# Altium schematic sheet TPS54292.SchDoc: 3.3V+1.2V
size A4; Date: 08.04.2017; Author: Jan Petrik; CompanyName: FreeDSP; DrawnBy: Jan Petrik; Organization: FreeDSP; DocumentNumber: 5; Revision: B2; SheetNumber: 5; SheetTotal: 16; email: jan_petrik@centrum.cz; license: CC BY-NC 4.0
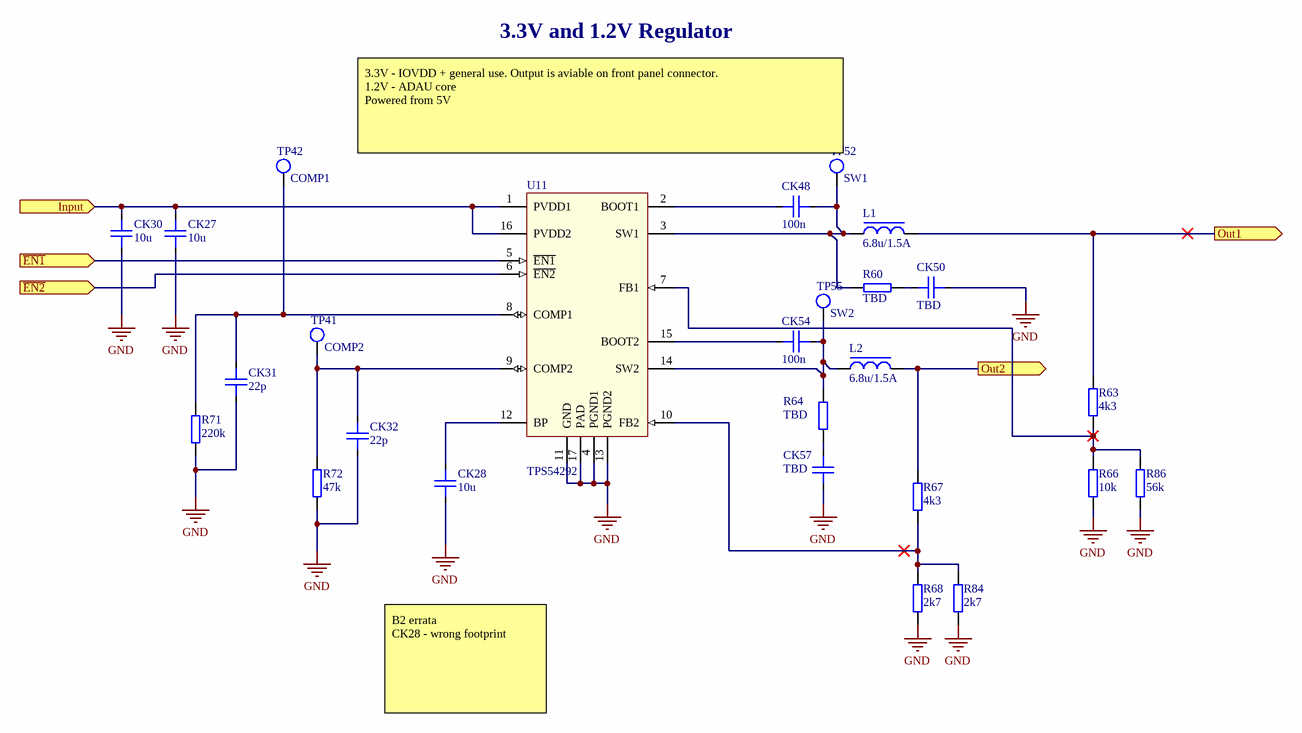
[diagram p0: TPS54292.SchDoc]

## Parts
CK27  10u  [CAPC3216X12N(SMC1206)]
CK28  10u  [CAPC3216X12N(SMC1206)]
CK30  10u  [CAPC3216X12N(SMC1206)]
CK31  22p  [CAPC1608X09N(SMC0603)]
CK32  22p  [CAPC1608X09N(SMC0603)]
CK48  100n  [CAPC1608X09N(SMC0603)]
CK50  TBD  [CAPC1608X09N(SMC0603)]
CK54  100n  [CAPC1608X09N(SMC0603)]
CK57  TBD  [CAPC1608X09N(SMC0603)]
L1  6.8u/1.5A  [INDM_3.8x3.8x1.8]
L2  6.8u/1.5A  [INDM_3.8x3.8x1.8]
R60  TBD  [RESC1608X06N(SMR0603)]
R63  4k3  [RESC1608X06N(SMR0603)]
R64  TBD  [RESC1608X06N(SMR0603)]
R66  10k  [RESC1608X06N(SMR0603)]
R67  4k3  [RESC1608X06N(SMR0603)]
R68  2k7  [RESC1608X06N(SMR0603)]
R71  220k  [RESC1608X06N(SMR0603)]
R72  47k  [RESC1608X06N(SMR0603)]
R84  2k7  [RESC1608X06N(SMR0603)]
R86  56k  [RESC1608X06N(SMR0603)]
TP41  COMP2  [TP_0.8/0.4_ROUND]  (no BOM)
TP42  COMP1  [TP_0.8/0.4_ROUND]  (no BOM)
TP52  SW1  [TP_0.8/0.4_ROUND]  (no BOM)
TP55  SW2  [TP_0.8/0.4_ROUND]  (no BOM)
U11  TPS54292  [TSOP65P640X120_HS-17M(TSSOP16-TP)]

## Ports
Input (in), Out1 (out), Out2 (out), ~{EN1} (in), ~{EN2} (in)

## Nets
GND: CK27.2 CK28.2 CK30.2 CK31.1 CK32.1 CK50.2 CK57.2 R66.1 R68.1 R71.1 R72.1 R84.1 R86.1 U11.4(PGND1) U11.11(GND) U11.13(PGND2) U11.17(PAD)
~{EN1}: U11.5(~{EN1}) ; port ~{EN1}
~{EN2}: U11.6(~{EN2}) ; port ~{EN2}
Input: CK27.1 CK30.1 U11.1(PVDD1) U11.16(PVDD2) ; port Input
Out1: L1.2 R63.2 ; port Out1
Out2: L2.2 R67.2 ; port Out2
NetCK28_1: CK28.1 U11.12(BP)
NetCK31_2: CK31.2 R71.2 TP42.1 U11.8(COMP1)
NetCK32_2: CK32.2 R72.2 TP41.1 U11.9(COMP2)
NetCK48_1: CK48.1 U11.2(BOOT1)
NetCK48_2: CK48.2 L1.1 R60.2 TP52.1 U11.3(SW1)
NetCK50_1: CK50.1 R60.1
NetCK54_1: CK54.1 U11.15(BOOT2)
NetCK54_2: CK54.2 L2.1 R64.2 TP55.1 U11.14(SW2)
NetCK57_1: CK57.1 R64.1
NetR63_1: R63.1 R66.2 R86.2 U11.7(FB1)
NetR67_1: R67.1 R68.2 R84.2 U11.10(FB2)

## Notes on the sheet
- 3.3V and 1.2V Regulator
- (near TP52) 3.3V - IOVDD + general use. Output is aviable on front panel connector.
  1.2V - ADAU core
  Powered from 5V
- B2 errata
  CK28 - wrong footprint
- Designed by:
- Sheet Title:
- Board Revision:
- License:
- Email:
- www.freedsp.cc
- www.pidsp.com
- Date:
- Sheet:
- /

## Library data of the parts
CK27 CK28 CK30 = 10u-50V-1206-X5R: MLCC; Signal Integrity: Cap; Voltage: 50; Tolerance: 10%; Mfgr. PN: GRM31CR61H106MA2L; Mfgr.: Murata; Value: 10u; Package: SMC1206; Simulation: Cap; Author: JP/10.06.2014; Supplier 1: Mouser; Supplier Part Number 1: 81-GRM31CR61H106MA2L
  CK27 CK30: ClassName: DirectConnect
CK31 CK32 = 22p-50V-0603-NP0: MLCC; Signal Integrity: Cap; Tolerance: 10%; Voltage: 50V; Value: 22p; Package: SMC0603; Simulation: Cap; Author: JP/27.03.2014; Supplier 1: Mouser; Supplier Part Number 1: 81-GCM1885C1H220J16D
CK48 CK54 = 100n-50V-0603-X7R: MLCC; Signal Integrity: Cap; Voltage: 50V; Tolerance: 10%; Value: 100n; Package: SMC2523; Simulation: Cap; Author: JP/27.03.2014; Supplier 1: Mouser; Supplier Part Number 1: 81-GRM39X104K50D
CK50 CK57 = ECK+100N50V0603XXK: MLCC, Size 0603, 100nF/50V, X7R; Value: 1n; Signal Integrity: Cap; Tolerance & Rating: 10%/50V; Package: SMC0603; Simulation: Cap; Author: JP/10.06.2014; SMD: 1
L1 L2 = IFSC1515AHER6R8M01: Low Profile, High Current Inductor; Tolerance & Rating: 20%, 1.5A/0.1Ohm DRC; Value: 6.8u/1.5A; Author: JM 29.5.2014; SMD: 1; Supplier 1: Mouser; Supplier Part Number 1: 70-IFSC1515AHER6R8M0; ClassName: DirectConnect
R60 R64 = ER+4K70.1W0603XXF: Thick Film resistor, Size 0603, 4k7, 0,1W, 1%; Tolerance & Rating: 1%/0.1W; Signal Integrity: Res; Value: tbd; Package: 0603; Simulation: Res; Author: JP/10.06.2014; SMD: 1
R63 R67 = 4K3-100mW-0603-ThickFilm: Chip Resistor; Tolerance & Rating: 1%/0.1W; Signal Integrity: Res; Packare: SMR0603; Value: 4k3; Simulation: Res; Author: JP/10.06.2014; SMD: 1; Supplier 1: Mouser; Supplier Part Number 1: 603-RC0603FR-074K3L; Type: Resistor
R66 = 10k-100mW-0603-ThickFilm: Chip Resistor; Tolerance & Rating: 1%/0.1W; Signal Integrity: Res; Packare: SMR0603; Value: 10k; Simulation: Res; Author: JP/10.06.2014; SMD: 1; Supplier 1: Mouser; Supplier Part Number 1: 603-RC0603FR-0710KL; Type: Resistor
R68 R84 = 2K7-100mW-0603-ThickFilm: Chip Resistor; Tolerance & Rating: 1%/0.1W; Signal Integrity: Res; Packare: SMR0603; Value: 2k7; Simulation: Res; Author: JP/26.03.2017; SMD: 1; Supplier 1: Mouser; Supplier Part Number 1: 603-RC0603FR-072K7L; Type: Resistor
R71 = 220k-100mW-0603-ThickFilm: Chip Resistor; Tolerance & Rating: 1%/0.1W; Signal Integrity: Res; Packare: SMR0603; Value: 220k; Simulation: Res; Author: JP/10.06.2014; SMD: 1; Supplier 1: Mouser; Supplier Part Number 1: 603-RC0603FR-07220KL; Type: Resistor
R72 = 47k-100mW-0603-ThickFilm: Chip Resistor; Tolerance & Rating: 1%/0.1W; Signal Integrity: Res; Packare: SMR0603; Value: 47k; Simulation: Res; Author: JP/10.06.2014; SMD: 1; Supplier 1: Mouser; Supplier Part Number 1: 603-RC0603FR-0747KL; Type: Resistor
R86 = 56k-100mW-0603-ThickFilm: Chip Resistor; Tolerance & Rating: 1%/0.1W; Signal Integrity: Res; Packare: SMR0603; Value: 56k; Simulation: Res; Author: JP/10.06.2014; SMD: 1; Supplier 1: Mouser; Supplier Part Number 1: 603-RC0603FR-0756KL; Type: Resistor
TP41 TP42 TP52 TP55 = TEST_POINT_VIA: Testpoint - VIA; Value: 0.65/1.55; SMD: -; ClassName: TP
U11 = TPS54292: 1.5-A/2.5-A Dual, Fully-Synchronous Buck Converter; Value: TPS54292; SMD: 1; Supplier 1: Mouser; Supplier Part Number 1: 595-TPS54292PWPR; ClassName: DirectConnect